# Altium project Wacky_Racer.PrjPcb
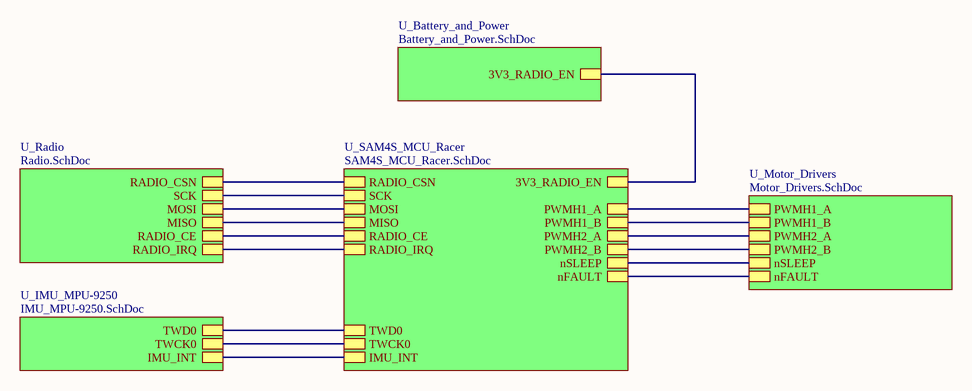
[diagram p0: Racer_Top_Level.SchDoc]
6 sheets, 131 parts. Net scope: hierarchical (ports join the sheet entries above them; power ports are global).
Board file: car_template 2020V3.PcbDoc
Sheets:
  Racer_Top_Level.SchDoc
    U_Battery_and_Power = Battery_and_Power.SchDoc
    U_Motor_Drivers = Motor_Drivers.SchDoc
    U_Radio = Radio.SchDoc
    U_SAM4S_MCU_Racer = SAM4S_MCU_Racer.SchDoc
    U_IMU_MPU-9250 = IMU_MPU-9250.SchDoc

## Sheet Racer_Top_Level.SchDoc
size A3; Address1: ECE Department; Address2: University of Canterbury; Address3: Christchurch 8041; Address4: New Zealand; Revision: 1

### Sub-sheets
U_Battery_and_Power = Battery_and_Power.SchDoc: 3V3_RADIO_EN
U_IMU_MPU-9250 = IMU_MPU-9250.SchDoc: TWD0, TWCK0, IMU_INT
U_Motor_Drivers = Motor_Drivers.SchDoc: PWMH1_A, PWMH1_B, PWMH2_A, PWMH2_B, nSLEEP, nFAULT
U_Radio = Radio.SchDoc: RADIO_CSN, SCK, MOSI, MISO, RADIO_CE, RADIO_IRQ
U_SAM4S_MCU_Racer = SAM4S_MCU_Racer.SchDoc: MISO, MOSI, SCK, RADIO_IRQ, PWMH1_A, PWMH1_B, PWMH2_A, PWMH2_B, nSLEEP, nFAULT, RADIO_CE, RADIO_CSN, 3V3_RADIO_EN, TWD0, TWCK0, IMU_INT

### Nets
MISO: sheet U_Radio/MISO, sheet U_SAM4S_MCU_Racer/MISO
MOSI: sheet U_Radio/MOSI, sheet U_SAM4S_MCU_Racer/MOSI
PWMH1_A: sheet U_Motor_Drivers/PWMH1_A, sheet U_SAM4S_MCU_Racer/PWMH1_A
PWMH2_A: sheet U_Motor_Drivers/PWMH2_A, sheet U_SAM4S_MCU_Racer/PWMH2_A
RADIO_CE: sheet U_Radio/RADIO_CE, sheet U_SAM4S_MCU_Racer/RADIO_CE
RADIO_CSN: sheet U_Radio/RADIO_CSN, sheet U_SAM4S_MCU_Racer/RADIO_CSN
RADIO_IRQ: sheet U_Radio/RADIO_IRQ, sheet U_SAM4S_MCU_Racer/RADIO_IRQ
SCK: sheet U_Radio/SCK, sheet U_SAM4S_MCU_Racer/SCK
TWCK0: sheet U_SAM4S_MCU_Racer/TWCK0, sheet U_IMU_MPU-9250/TWCK0
TWD0: sheet U_SAM4S_MCU_Racer/TWD0, sheet U_IMU_MPU-9250/TWD0
NetR??_2: sheet U_Battery_and_Power/3V3_RADIO_EN, sheet U_SAM4S_MCU_Racer/3V3_RADIO_EN
NetU1_37: sheet U_SAM4S_MCU_Racer/IMU_INT, sheet U_IMU_MPU-9250/IMU_INT
NetU1_41: sheet U_Motor_Drivers/nSLEEP, sheet U_SAM4S_MCU_Racer/nSLEEP
NetU1_42: sheet U_Motor_Drivers/nFAULT, sheet U_SAM4S_MCU_Racer/nFAULT
NetU1_44: sheet U_Motor_Drivers/PWMH2_B, sheet U_SAM4S_MCU_Racer/PWMH2_B
NetU1_47: sheet U_Motor_Drivers/PWMH1_B, sheet U_SAM4S_MCU_Racer/PWMH1_B

### Notes on the sheet
- Title
- Drawn by:
- Date:
- Time:
- Revision:
- Sheet
- of
- File:

## Sheet Battery_and_Power.SchDoc
size A3; Address1: ECE Department; Address2: University of Canterbury; Address3: Christchurch 8041; Address4: New Zealand; Revision: 1
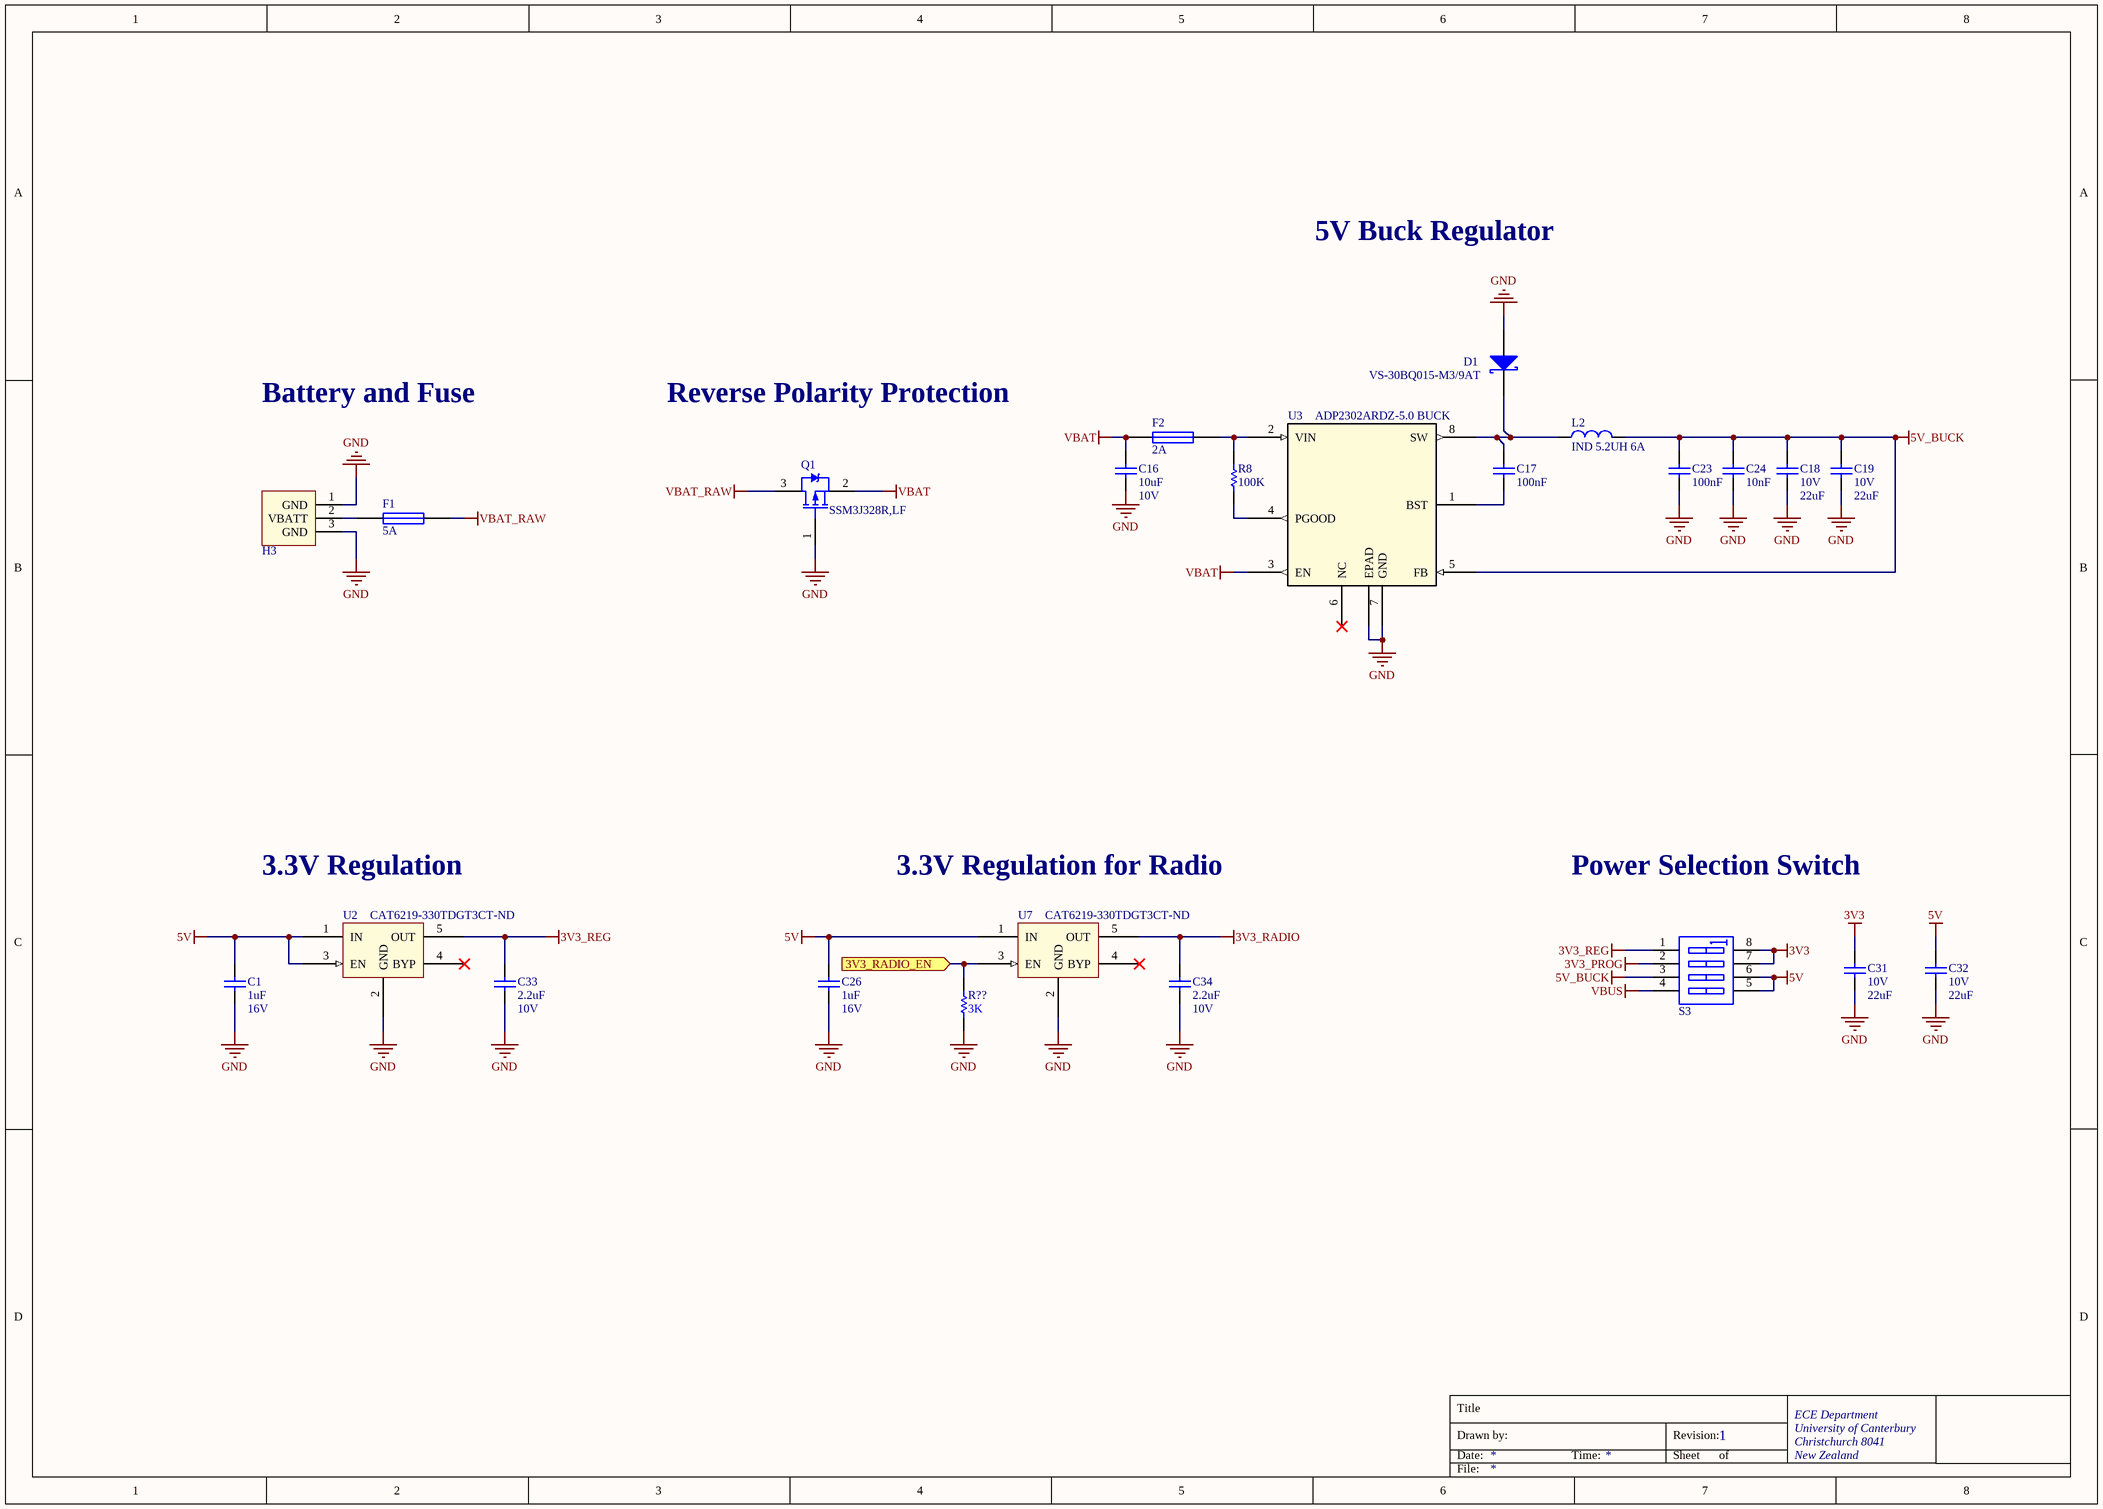
[diagram p1: Battery_and_Power.SchDoc]

### Parts
C1  Max Voltage: 16V  [CAPC1608L]  (hidden comment: 1uF)
C16  Max Voltage: 10V  [CAPC2012L]  (hidden comment: 10uF)
C17  100nF  [CAPC1608L]
C18  Max Voltage: 10V  [CAPC3216L]  (hidden comment: 22uF)
C19  Max Voltage: 10V  [CAPC3216L]  (hidden comment: 22uF)
C23  100nF  [CAPC1608L]
C24  10nF  [CAPC1608L]
C26  Max Voltage: 16V  [CAPC1608L]  (hidden comment: 1uF)
C31  Max Voltage: 10V  [CAPC3216L]  (hidden comment: 22uF)
C32  Max Voltage: 10V  [CAPC3216L]  (hidden comment: 22uF)
C33  Max Voltage: 10V  [CAPC1608L]  (hidden comment: 2.2uF)
C34  Max Voltage: 10V  [CAPC1608L]  (hidden comment: 2.2uF)
D1  VS-30BQ015-M3/9AT  [SMC]
F1  5A  [RESC3216N]
F2  2A  [RESC3216N]
H3  Battery_HEADER_3pin  [BATT_HEADER_3POS]  (value not drawn)
L2  IND 5.2UH 6A  [INDUCTOR5u2]
Q1  SSM3J328R,LF  [SOT23_L]
R8  100K  [RESC1608L]
R??  3K  [RESC1608L]
S3  WS_SW DIP-4  [DIP_SW_4WAY_SMD -]  (value not drawn)
U2  Supplier Part Number: CAT6219-330TDGT3CT-ND  [SOT95P280X145-5N]  (hidden comment: CAT6219-330TDGT3)
U3  ADP2302ARDZ-5.0 BUCK  [RD_8_1]
U7  Supplier Part Number: CAT6219-330TDGT3CT-ND  [SOT95P280X145-5N]  (hidden comment: CAT6219-330TDGT3)

### Ports
3V3_RADIO_EN (in)

### Nets
3V3: C31.2 S3.7(B2) S3.8(B1)
3V3_PROG: S3.2(A2)
3V3_RADIO: C34.2 U7.5(OUT)
3V3_REG: C33.2 S3.1(A1) U2.5(OUT)
5V: C1.2 C26.2 C32.2 S3.5(B4) S3.6(B3) U2.1(IN) U2.3(EN) U7.1(IN)
5V_BUCK: C18.2 C19.2 C23.2 C24.2 L2.2 S3.3(A3) U3.5(FB)
GND: C1.1 C16.1 C18.1 C19.1 C23.1 C24.1 C26.1 C31.1 C32.1 C33.1 C34.1 D1.1(A) H3.1(GND) H3.3(GND) Q1.1 R??.1 U2.2(GND) U3.7(GND) U3.EPAD U7.2(GND)
VBAT: C16.2 F2.1 Q1.2 U3.3(EN)
VBAT_RAW: F1.2 Q1.3
VBUS: S3.4(A4)
NetC17_1: C17.1 U3.1(BST)
NetC17_2: C17.2 D1.2(K) L2.1 U3.8(SW)
NetF1_1: F1.1 H3.2(VBATT)
NetF2_2: F2.2 R8.2 U3.2(VIN)
NetR8_1: R8.1 U3.4(PGOOD)
NetR??_2: R??.2 U7.3(EN) ; port 3V3_RADIO_EN

Not connected (* = marked no-connect by the designer): U2 4(BYP)*; U3 6(NC)*; U7 4(BYP)*

### Notes on the sheet
- 5V Buck Regulator
- Battery and Fuse
- Reverse Polarity Protection
- 3.3V Regulation
- 3.3V Regulation for Radio
- Power Selection Switch
- Title
- Drawn by:
- Date:
- Time:
- Revision:
- Sheet
- of
- File:

### Library data of the parts
C1 C26 = CC_1uF_0603: CAP CER 1uF Y5V -20% +80% 16V 0603; PackageReference: 0603; Code_IPC: 1608 [0603]; Verify: *; Supplier: ECE Dept; Storage Location: PCB Assembly WS; Value: 1uF
C16 = CC_10uF_0805_10V: CAP CER 10uF X7R +-20% 10V 0805; Note: Footprint corresponds to dimensions for bulk cassette packaging. This case size has tightened tolerances.; PackageReference: 0805; Code_IPC: 2012[0805]; Verify: *; Supplier: ECE Dept; Storage Location: PCB Assembly WS; Value: 10uF
C17 C23 = CC_100nF_0603: CAP CER 100nF X7R +-10% 50V 0603; PackageReference: 0603; Code_IPC: 1608 [0603]; Verify: *; Supplier: ECE Dept; Storage Location: PCB Assembly WS; Value: 100nF
C18 C19 C31 C32 = CC_22uF_1206: CAP CER 22uF Y5V -20% +80% 10V 1206; Verify: *; Supplier: ECE Dept; Storage Location: PCB Assembly WS; Dielectric: Y5V; Footprint: 1206 (3216 metric); Value: 22uF
C24 = CC_10nF_0603: CAP CER 10nF X7R +-10% 50V 0603; PackageReference: 0603; Code_IPC: 1608 [0603]; Verify: *; Supplier: ECE Dept; Storage Location: PCB Assembly WS; Value: 10nF
C33 C34 = CC_2.2uF_0603: CAP CER 2.2uF X5R +-20% 10V 0603; PackageReference: 0603; Code_IPC: 1608 [0603]; Verify: *; Supplier: ECE Dept; Storage Location: PCB Assembly WS; Value: 2.2uF
D1 = DS_VS-30BQ015-M3: DIODE, SCHOTTKY, 3A, 15V, DO-214AB / SMC; Manufacturer: Vishay Semiconductors; Forward Voltage: 350mV; Max Forward Surge Current (Ifsm): 650A; Peak Reverse Current: 4mA; Average Rectified Current: 3A; Max Reverse Voltage (DC): 15V; Supplier: Digi-Key; ComponentLink1URL: https://datasheet.ciiva.com/36181/vs-30bq015-m3-9at-36181258.pdf; ComponentLink1Description: https://datasheet.ciiva.com/36181/vs-30bq015-m3-9at-36181258.pdf; Supplier 1: Digi-Key; Supplier 2: Element14; Supplier Part Number 1: VS-30BQ015-M3/9ATGIDKR-ND; Supplier Part Number 2: 2628288; Supplier Part Number: VS-30BQ015-M3/9AT-ND; Manufacturer Part Number: VS-30BQ015-M3/9AT
F1 = FS_Fuse_5.0A: Fuse 5.0A Fast Acting 1206 SMD; Manufacturer Part Number: C1F5; Manufacturer: Bel TRP; Voltage Rating (AC): 125V; Voltage Rating (DC): 63V; DC Cold Resistance: 19mR; Fuse Type: Board Mount (Cartridge Style Excluded); Approvals: CE,cURus; Mount: Surface Mount; Case/Package: 1206; Number of Pins: 2; Case Code (Metric): 3216; Case Code (Imperial): 1206; Contact Plating: Nickel,Tin; Min Operating Temperature: -55°C; Max Operating Temperature: 125°C; Packaging: Tape and Reel; Voltage Rating: 125V; Length: 0.126inch; Width: 0.062inch; Supplier 1: Digi-Key; Stock 1: 725; Pricing 1: 1=0.32, 5=0.312, 10=0.298, 50=0.2662, 100=0.2479, 250=0.22032, 500=0.1836, 1000=0.17442 (USD); ComponentLink1URL: http://www.farnell.com/datasheets/2571625.pdf; ComponentLink1Description: http://www.farnell.com/datasheets/2571625.pdf; ComponentLink2URL: http://belfuse.com/pdfs/C1F.pdf; ComponentLink2Description: http://belfuse.com/pdfs/C1F.pdf; ComponentLink3URL: http://www.mouser.com/ds/2/643/C1F-594910.pdf; ComponentLink3Description: http://www.mouser.com/ds/2/643/C1F-594910.pdf; ComponentLink4URL: https://belfuse.com/resources/StewartConnector/C1F.pdf; ComponentLink4Description: https://belfuse.com/resources/StewartConnector/C1F.pdf; Current Rating: 5A; Supplier Part Number 1: 507-1886-1-ND; Supplier 2: Element14; Supplier Part Number 2: 2848595; Value: 5A
F2 = FS_Fuse_2.0A: Fuse 2.0A Very Fast Acting 1206 SMD; Manufacturer: MULTICOMP; Manufacturer PN: MC12CF 002; Supplier: ECE Dept; Storage Location: PCB Assembly WS; Supplier 1: Farnell; Supplier Part Number 1: 1841029; Manufacturer Part Number: MC12CF 002; Value: 2A
H3 = Battery_HEADER_3pin: 3Pin Header 2.54mm spacing
L2 = CDRH104RNP-5R2NC: FIXED IND 5.2UH 6A 22 MOHM SMD; Manufacturer: Sumida America Components Inc.; Material - Core: Ferrite; Tolerance: ±30%; Current - Saturation: 5.6A; Shielding: Shielded; DC Resistance (DCR): 22 mOhm Max; Supplier 1: Digi-Key; Manufacturer Part Number: CDRH104RNP-5R2NC; RoHS: RoHS Compliant; Category: Inductors, Coils, Chokes; Stock 1: 3849; Pricing 1: 1=2.9, 10=2.678, 100=1.8743, 500=1.5173 (NZD); Packaging: Cut Tape (CT); Part Status: Active; Type: -; Q @ Freq: -; Frequency - Self Resonant: -; Ratings: -; Operating Temperature: -40°C ~ 100°C; Mounting Type: Surface Mount; Package / Case: Nonstandard; Supplier Device Package: -; Size / Dimension: 0.402" L x 0.394" W (10.20mm x 10.00mm); Height - Seated (Max): 0.157" (4.00mm); ComponentLink1URL: http://products.sumida.com/products/pdf/CDRH104R.pdf; ComponentLink1Description: http://products.sumida.com/products/pdf/CDRH104R.pdf; Supplier Part Number 1: 308-2280-1-ND
Q1 = TM_SSM3J328R: MOSFET P-CH 20V 6A SOT23-3; Manufacturer: Toshiba; FET Feature: Logic Level Gate, 1.5V Drive; FET Type: MOSFET P-Channel, Metal Oxide; Gate Charge (Qg) @ Vgs: 12.8nC @ 4.5V; Input Capacitance (Ciss) @ Vds: 840pF @ 10V; Power - Max: 1W; Rds On Max: 29.8mR; Drain to Source Resistance: 47.4mR; Turn-On Delay Time: 32ns; Power Dissipation: 2W; Number of Channels: 1; Turn-Off Delay Time: 107ns; Gate to Source Voltage (Vgs): 8V; Input Capacitance: 840pF; Element Configuration: Single; Drain to Source Breakdown Voltage: -20V; Vgs(th) (Max) @ Id: 1V @ 1mA; Current - Continuous Drain (Id) @ 25° C: 6A; Drain to Source Voltage (Vdss): 20V; Package / Case: SOT-23-3 Flat Leads; Supplier Device Package: SOT-23F; Pricing: 1=0.79, 10=0.658, 25=0.5772, 100=0.4939, 250=0.42836, 500=0.36284, 1000=0.27972 (NZD); Storage Location: PCB Assembly WS; Supplier: Digi-Key; ComponentLink1URL: https://datasheet.ciiva.com/11158/ssm3j328r-datasheet-en-20140301-11158652.pdf; ComponentLink1Description: https://datasheet.ciiva.com/11158/ssm3j328r-datasheet-en-20140301-11158652.pdf; Supplier Part Number: SSM3J328RLFDKR-ND; Max Operating Temperature: 150°C; Mount: Surface Mount; Packaging: Tape and Reel; Min Operating Temperature: -55°C; Continuous Drain Current (ID): 6A; Radiation Hardening: No; Max Power Dissipation: 1W; Package Quantity: 3000; Case/Package: SOT-23-3; Number of Pins: 3; Number of Elements: 1; Supplier 1: Digi-Key; Supplier Part Number 1: SSM3J328RLFDKR-ND; Manufacturer Part Number: SSM3J328R,LF
R8 = RS_100K: RES 100K OHM 1/10W 5% 0603 SMD; Storage Location: PCB Assembly WS; Supplier: ECE Dept; Value: 100K
R?? = RS_3K: RES 3K OHM 1/10W 5% 0603 SMD; Storage Location: PCB Assembly WS; Supplier: ECE Dept; Value: 3K
S3 = WS_SW DIP-4: DIP Switch, 4 Position, SPST SMD; Manufacturer: OMRON ELECTRONIC COMPONENTS; Manufacturer Part Number: A6SN-4101; Contact Current DC Max: 25; External Length / Height: 12.1; No. of Switch Positions: 4; Pitch Spacing: 2.54; Contact Configuration: SPST; Supplier 1: Farnell; Supplier Part Number 1: 2029425; Storage Location: PCB Assembly WS; Supplier: ECE Dept
U2 U7 = SV_CAT6219-330TDGT3: IC REG LIN 3.3V 500MA TSOT23-5; Voltage - Input (Max): 5.5V; Voltage Dropout (Max): 0.5V @ 500mA; Manufacturer Part Number: CAT6219-330TDGT3; Base Part Number: CAT6219; Current - Output: 500mA; Package / Case: SOT-23-5 Thin, TSOT-23-5; Supplier: Digi-Key; Supplier Device Package: TSOT-23-5; Voltage - Output (Min/Fixed): 3.3V; ComponentLink1URL: http://www.onsemi.com/pub/Collateral/CAT6219-D.PDF; ComponentLink1Description: http://www.onsemi.com/pub/Collateral/CAT6219-D.PDF; Supplier 1: Digi-Key
U3 = ADP2302ARDZ-5.0-R7: IC REG BUCK 5V 2A 8SOIC; Vendor: Analog Devices Inc; Frequency - Switching: 700kHz; Output Type: Fixed; Voltage - Input (Max): 20V; Manufacturer_Part_Number: ADP2302ARDZ-5.0-R7; Type: DEV; Value: Value; Supplier 1: Digi-Key; Current - Output: 2A; Voltage - Output (Min/Fixed): 5V; Supplier Part Number 1: ADP2302ARDZ-5.0-R7CT-ND

## Sheet Motor_Drivers.SchDoc
size A3; Address1: ECE Department; Address2: University of Canterbury; Address3: Christchurch 8041; Address4: New Zealand; Revision: 1
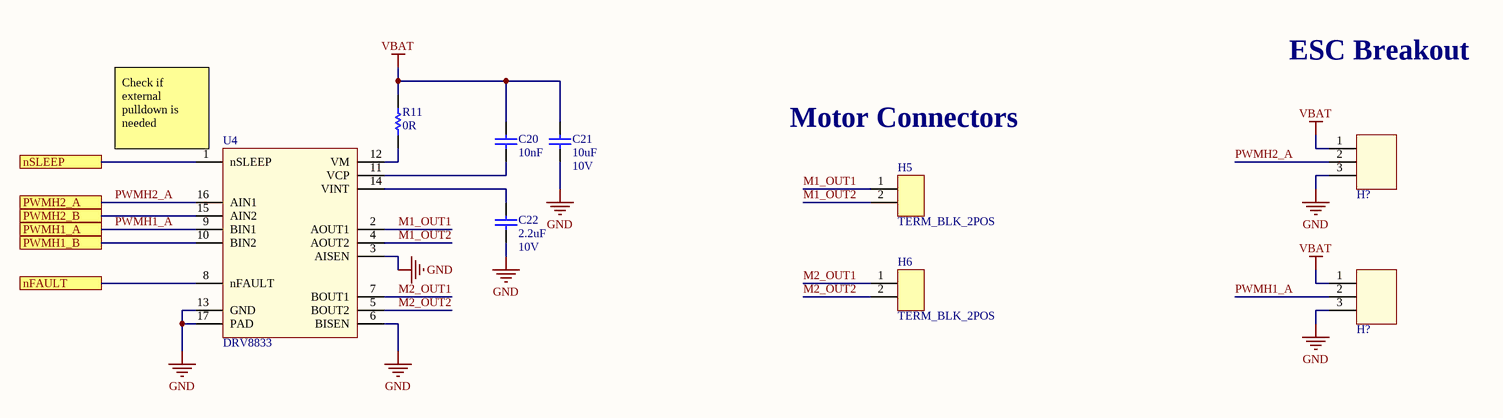
[diagram p2: Motor_Drivers.SchDoc]

### Parts
(Parts that share a designator on the sheet are numbered #1, #2 ... from top to bottom, then left to right.)
C20  10nF  [CAPC1608L]
C21  Max Voltage: 10V  [CAPC2012L]  (hidden comment: 10uF)
C22  Max Voltage: 10V  [CAPC1608L]  (hidden comment: 2.2uF)
H5  TERM_BLK_2POS  [TERM_BLK_2POS]
H6  TERM_BLK_2POS  [TERM_BLK_2POS]
H7#1  HEADER_3  [HEADER_3POS]  (value not drawn)
H8  HEADER_3  [HEADER_3POS]  (value not drawn)
R11  0R  [RESC1608L]
U4  DRV8833  [HTSOP16]

### Ports
nFAULT, nSLEEP, PWMH1_A, PWMH1_B, PWMH2_A, PWMH2_B

### Nets
GND: C21.1 C22.1 H7#1.3 H8.3 U4.3(AISEN) U4.6(BISEN) U4.13(GND) U4.17(PAD)
VBAT: C20.2 C21.2 H7#1.1 H8.1 R11.2
M1_OUT1: H5.1 U4.2(AOUT1)
M1_OUT2: H5.2 U4.4(AOUT2)
M2_OUT1: H6.1 U4.7(BOUT1)
M2_OUT2: H6.2 U4.5(BOUT2)
PWMH1_A: H8.2 U4.9(BIN1) ; port PWMH1_A
PWMH2_A: H7#1.2 U4.16(AIN1) ; port PWMH2_A
NetC20_1: C20.1 U4.11(VCP)
NetC22_2: C22.2 U4.14(VINT)
NetR11_1: R11.1 U4.12(VM)
NetU1_41: U4.1(nSLEEP) ; port nSLEEP
NetU1_42: U4.8(nFAULT) ; port nFAULT
NetU1_44: U4.15(AIN2) ; port PWMH2_B
NetU1_47: U4.10(BIN2) ; port PWMH1_B

### Notes on the sheet
- ESC Breakout
- (near U4) Check if external pulldown is needed
- Motor Connectors
- Title
- Drawn by:
- Date:
- Time:
- Revision:
- Sheet
- of
- File:

### Library data of the parts
C20 = CC_10nF_0603: CAP CER 10nF X7R +-10% 50V 0603; PackageReference: 0603; Code_IPC: 1608 [0603]; Verify: *; Supplier: ECE Dept; Storage Location: PCB Assembly WS; Value: 10nF
C21 = CC_10uF_0805_10V: as C16 on sheet Battery_and_Power; PackageReference: 0805; Code_IPC: 2012[0805]; Verify: *; Supplier: ECE Dept; Storage Location: PCB Assembly WS; Value: 10uF
C22 = CC_2.2uF_0603: CAP CER 2.2uF X5R +-20% 10V 0603; PackageReference: 0603; Code_IPC: 1608 [0603]; Verify: *; Supplier: ECE Dept; Storage Location: PCB Assembly WS; Value: 2.2uF
H5 H6 = TERM_BLK_2POS: 2 Position Terminal Block 7.62mm spacing
H7#1 H8 = HEADER_3: 3Pin Header 2.54mm spacing
R11 = RS_0R0: RES 0.0 OHM 1/10W 5% 0603 SMD; Storage Location: PCB Assembly WS; Supplier: ECE Dept; Value: 0R
U4 = DRV8833: Dual H-Bridge Motor Driver 1.5A

## Sheet Radio.SchDoc: Wacky Control Radio
size A3; Author: Josiah Craw; Address1: ECE Department; Address2: University of Canterbury; Address3: Christchurch 8041; Address4: New Zealand; Revision: 1
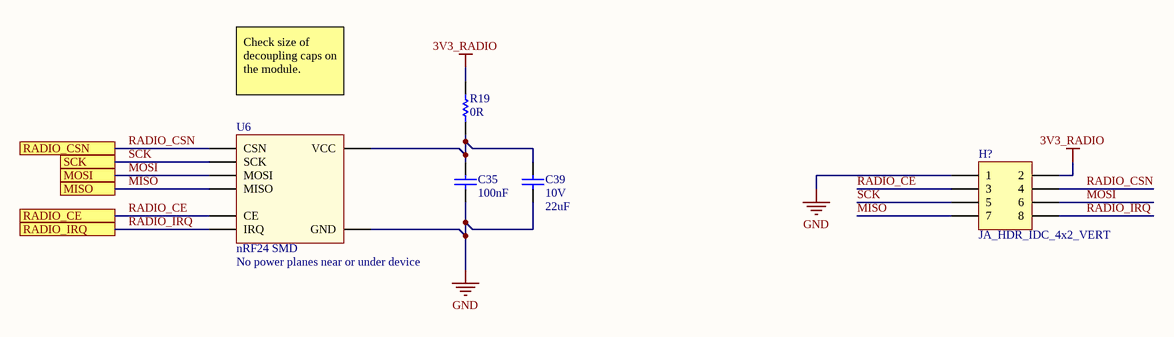
[diagram p3: Radio.SchDoc]

### Parts
C35  100nF  [CAPC1608L]
C39  Max Voltage: 10V  [CAPC3216L]  (hidden comment: 22uF)
H10  JA_HDR_IDC_4x2_VERT  [IDC2.54-V08D]
R19  0R  [RESC1608L]
U6  nRF24 SMD  Warning: No power planes near or under device  [NRF24]

### Ports
MISO, MOSI, RADIO_CE, RADIO_CSN, RADIO_IRQ, SCK

### Nets
3V3_RADIO: H10.2 R19.2
GND: C35.1 C39.1 H10.1 U6.2(GND)
MISO: H10.7 U6.7(MISO) ; port MISO
MOSI: H10.6 U6.6(MOSI) ; port MOSI
RADIO_CE: H10.3 U6.3(CE) ; port RADIO_CE
RADIO_CSN: H10.4 U6.4(CSN) ; port RADIO_CSN
RADIO_IRQ: H10.8 U6.8(IRQ) ; port RADIO_IRQ
SCK: H10.5 U6.5(SCK) ; port SCK
NetC35_2: C35.2 C39.2 R19.1 U6.1(VCC)

### Notes on the sheet
- Check size of decoupling caps on the module.

### Library data of the parts
C35 = CC_100nF_0603: CAP CER 100nF X7R +-10% 50V 0603
C39 = CC_22uF_1206: CAP CER 22uF Y5V -20% +80% 10V 1206
H10 = JA_HDR_IDC_4x2_VERT: IDC Header, 2.54mm, 8-Pin, Vert; Manufacturer: Amphenol FCI; Manufacturer Part Number: 75869-132LF; Number of Positions: 8; Max Voltage Rating (AC): 500V; Connector Type: Male Pin; Gender: Male; Current Rating: 3A; Row Spacing: 0.1inch; Mating Post Length: 6mm
R19 = RS_0R0: RES 0.0 OHM 1/10W 5% 0603 SMD
U6 = NRF24: nRF24 SMD Module

## Sheet SAM4S_MCU_Racer.SchDoc: Wacky2020 AD19 HAT test
size A3; DrawnBy: Group 19; Address1: ECE Department; Address2: University of Canterbury; Address3: Christchurch 8041; Address4: New Zealand; Revision: 1
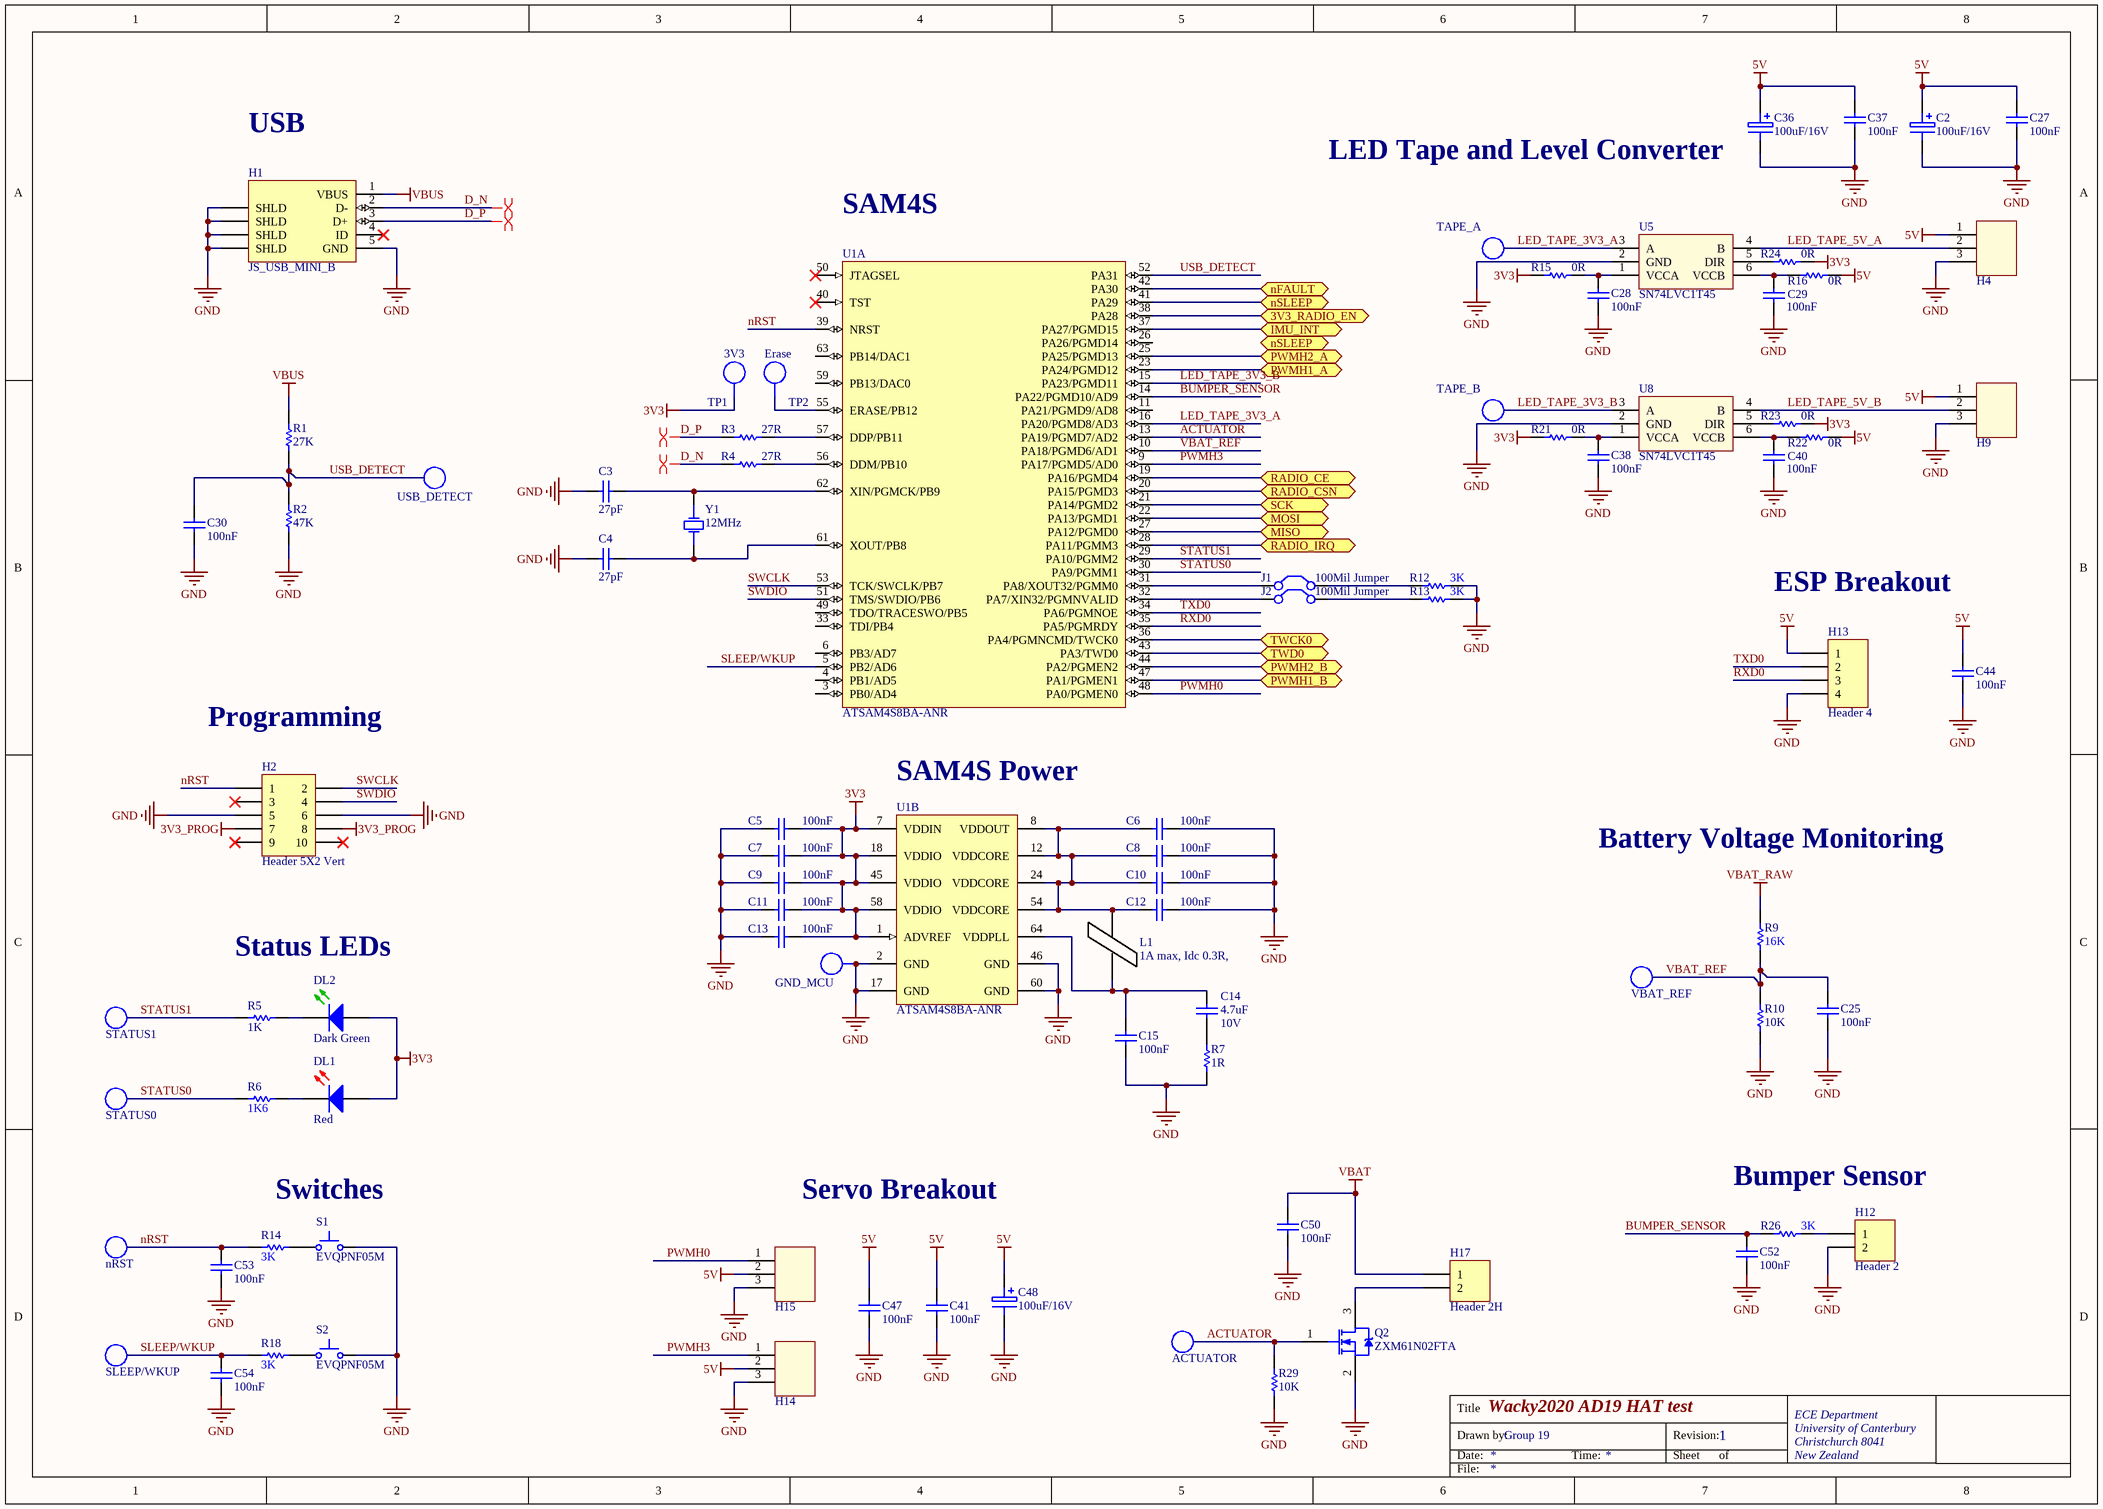
[diagram p4: SAM4S_MCU_Racer.SchDoc]

### Parts
(Parts that share a designator on the sheet are numbered #1, #2 ... from top to bottom, then left to right.)
ACTUATOR  TP_0603  [TP_0603]  (value not drawn)
C2  100uF/16V  [NICH-1]
C3  27pF  [CAPC1608L]
C4  27pF  [CAPC1608L]
C5  100nF  [CAPC1608L]
C6  100nF  [CAPC1608L]
C7  100nF  [CAPC1608L]
C8  100nF  [CAPC1608L]
C9  100nF  [CAPC1608L]
C10  100nF  [CAPC1608L]
C11  100nF  [CAPC1608L]
C12  100nF  [CAPC1608L]
C13  100nF  [CAPC1608L]
C14  Max Voltage: 10V  [CAPC1608N]  (hidden comment: 4.7uF)
C15  100nF  [CAPC1608L]
C25  100nF  [CAPC1608L]
C27  100nF  [CAPC1608L]
C28  100nF  [CAPC1608L]
C29  100nF  [CAPC1608L]
C30  100nF  [CAPC1608L]
C36#1  100uF/16V  [NICH-1]
C37#1  100nF  [CAPC1608L]
C38#1  100nF  [CAPC1608L]
C40  100nF  [CAPC1608L]
C41  100nF  [CAPC1608L]
C44  100nF  [CAPC1608L]
C47  100nF  [CAPC1608L]
C48  100uF/16V  [NICH-1]
C50  100nF  [CAPC1608L]
C52  100nF  [CAPC1608L]
C53  100nF  [CAPC1608L]
C54  100nF  [CAPC1608L]
DL1  Red  [WL-SMCW0603]
DL2  Dark Green  [WL-SMCW0603]
GND_MCU  TP  [TP_1206]  (value not drawn)  (no BOM)
H1  JS_USB_MINI_B  [USB/SM0.8-6H5]
H2  Header 5X2 Vert  [IDC2.54-V10D]
H4  HEADER_3  [HEADER_3POS]  (value not drawn)
H9  HEADER_3  [HEADER_3POS]  (value not drawn)
H12  Header 2  [HDR1X2]
H13  Header 4  [HDR1X4]
H14  HEADER_3  [HEADER_3POS]  (value not drawn)
H15  HEADER_3  [HEADER_3POS]  (value not drawn)
H17  Header 2H  [HDR1X2H]
J1  100Mil Jumper  [JMP2.54]
J2  100Mil Jumper  [JMP2.54]
L1  1A max, Idc 0.3R,  [INDC3216L]
nRST  TP_0603  [TP_0603]  (value not drawn)
Q2  ZXM61N02FTA  [SOT23_L]
R1  27K  [RESC1608L]
R2  47K  [RESC1608N]
R3  27R  [RESC1608L]
R4  27R  [RESC1608L]
R5  1K  [RESC1608L]
R6  1K6  [RESC1608L]
R7  1R  [RESC3216L]
R9  16K  [RESC1608L]
R10  10K  [RESC1608L]
R12  3K  [RESC1608L]
R13  3K  [RESC1608L]
R14  3K  [RESC1608L]
R15  0R  [RESC1608L]
R16  0R  [RESC1608L]
R18  3K  [RESC1608L]
R21  0R  [RESC1608L]
R22  0R  [RESC1608L]
R23  0R  [RESC1608L]
R24  0R  [RESC1608L]
R26  3K  [RESC1608L]
R29  10K  [RESC1608L]
S1  EVQPNF05M  [EVQPNF05M]
S2  EVQPNF05M  [EVQPNF05M]
SLEEP/WKUP  TP_0603  [TP_0603]  (value not drawn)
STATUS0  TP_0603  [TP_0603]  (value not drawn)
STATUS1  TP_0603  [TP_0603]  (value not drawn)
TAPE_A  TP_0603  [TP_0603]  (value not drawn)
TAPE_B  TP_0603  [TP_0603]  (value not drawn)
TP1  3V3  [TP_1206]  (no BOM)
TP2  Erase  [TP_1206]  (no BOM)
U1  ATSAM4S8BA-ANR  [LQFP64_L]  (parts A,B of 2)
U5  SN74LVC1T45  [SOT23-6_N]
U8#1  SN74LVC1T45  [SOT23-6_N]
USB_DETECT  TP_0603  [TP_0603]  (value not drawn)
VBAT_REF  TP_0603  [TP_0603]  (value not drawn)
Y1  12MHz  [6.0X3.5-4]

### Ports
3V3_RADIO_EN (bidir), IMU_INT (bidir), MISO (bidir), MOSI (bidir), nFAULT (bidir), nSLEEP (bidir), PWMH1_A (bidir), PWMH1_B (bidir), PWMH2_A (bidir), PWMH2_B (bidir), RADIO_CE (bidir), RADIO_CSN (bidir), RADIO_IRQ (bidir), SCK (bidir), TWCK0 (bidir), TWD0 (bidir)

### Nets
3V3: C5.2 C7.2 C9.2 C11.2 C13.2 DL1.2(A) DL2.2(A) R15.1 R21.1 R23.2 R24.2 TP1.1 U1.1(ADVREF) U1.7(VDDIN) U1.18(VDDIO) U1.45(VDDIO) U1.58(VDDIO)
3V3_PROG: H2.7 H2.8
5V: C2.2 C27.2 C36#1.2 C37#1.2 C41.2 C44.2 C47.2 C48.2 H4.1 H9.1 H13.1 H14.2 H15.2 R16.2 R22.2
GND: C2.1 C3.1 C4.1 C5.1 C6.2 C7.1 C8.2 C9.1 C10.2 C11.1 C12.2 C13.1 C15.2 C25.1 C27.1 C28.1 C29.1 C30.1 C36#1.1 C37#1.1 C38#1.1 C40.1 C41.1 C44.1 C47.1 C48.1 C50.1 C52.1 C53.1 C54.1 GND_MCU.1 H1.5(GND) H1.6(SHLD) H1.7(SHLD) H1.8(SHLD) H1.9(SHLD) H2.5 H2.6 H4.3 H9.3 H12.2 H13.4 H14.3 H15.3 Q2.2 R2.1 R7.1 R10.1 R12.2 R13.2 R29.1 S1.1 S2.1 U1.2(GND) U1.17(GND) U1.46(GND) U1.60(GND) U5.2(GND) U8#1.2(GND)
VBAT: C50.2 H17.1
VBAT_RAW: R9.2
VBUS: H1.1(VBUS) R1.2
ACTUATOR: ACTUATOR.1(TP) Q2.1 R29.2 U1.13(PA19/PGMD7/AD2)
BUMPER_SENSOR: C52.2 R26.1 U1.14(PA22/PGMD10/AD9)
D_N: H1.2(D-) R4.1
D_P: H1.3(D+) R3.1
LED_TAPE_3V3_A: TAPE_A.1(TP) U1.16(PA20/PGMD8/AD3) U5.3(A)
LED_TAPE_3V3_B: TAPE_B.1(TP) U1.15(PA23/PGMD11) U8#1.3(A)
LED_TAPE_5V_A: H4.2 U5.4(B)
LED_TAPE_5V_B: H9.2 U8#1.4(B)
MISO: U1.27(PA12/PGMD0) ; port MISO
MOSI: U1.22(PA13/PGMD1) ; port MOSI
nRST: C53.2 H2.1 nRST.1(TP) R14.1 U1.39(NRST)
PWMH0: H15.1 U1.48(PA0/PGMEN0)
PWMH1_A: U1.23(PA24/PGMD12) ; port PWMH1_A
PWMH2_A: U1.25(PA25/PGMD13) ; port PWMH2_A
PWMH3: H14.1 U1.9(PA17/PGMD5/AD0)
RADIO_CE: U1.19(PA16/PGMD4) ; port RADIO_CE
RADIO_CSN: U1.20(PA15/PGMD3) ; port RADIO_CSN
RADIO_IRQ: U1.28(PA11/PGMM3) ; port RADIO_IRQ
RXD0: H13.3 U1.35(PA5/PGMRDY)
SCK: U1.21(PA14/PGMD2) ; port SCK
SLEEP/WKUP: C54.2 R18.1 SLEEP/WKUP.1(TP) U1.5(PB2/AD6)
STATUS0: R6.1 STATUS0.1(TP) U1.30(PA9/PGMM1)
STATUS1: R5.1 STATUS1.1(TP) U1.29(PA10/PGMM2)
SWCLK: H2.2 U1.53(TCK/SWCLK/PB7)
SWDIO: H2.4 U1.51(TMS/SWDIO/PB6)
TWCK0: U1.36(PA4/PGMNCMD/TWCK0) ; port TWCK0
TWD0: U1.43(PA3/TWD0) ; port TWD0
TXD0: H13.2 U1.34(PA6/PGMNOE)
USB_DETECT: C30.2 R1.1 R2.2 U1.52(PA31) USB_DETECT.1(TP)
VBAT_REF: C25.2 R9.1 R10.2 U1.10(PA18/PGMD6/AD1) VBAT_REF.1(TP)
NetC3_2: C3.2 U1.62(XIN/PGMCK/PB9) Y1.3(OSC2)
NetC4_2: C4.2 U1.61(XOUT/PB8) Y1.1(OSC1)
NetC6_1: C6.1 C8.1 C10.1 C12.1 L1.2 U1.8(VDDOUT) U1.12(VDDCORE) U1.24(VDDCORE) U1.54(VDDCORE)
NetC14_1: C14.1 R7.2
NetC14_2: C14.2 C15.1 L1.1 U1.64(VDDPLL)
NetC28_2: C28.2 R15.2 U5.1(VCCA)
NetC29_2: C29.2 R16.1 U5.6(VCCB)
NetC38#1_2: C38#1.2 R21.2 U8#1.1(VCCA)
NetC40_2: C40.2 R22.1 U8#1.6(VCCB)
NetDL1_1: DL1.1(K) R6.2
NetDL2_1: DL2.1(K) R5.2
NetH12_1: H12.1 R26.2
NetH17_2: H17.2 Q2.3
NetJ1_1: J1.1(C1) U1.31(PA8/XOUT32/PGMM0)
NetJ1_2: J1.2(C2) R12.1
NetJ2_1: J2.1(C1) U1.32(PA7/XIN32/PGMNVALID)
NetJ2_2: J2.2(C2) R13.1
NetR3_2: R3.2 U1.57(DDP/PB11)
NetR4_2: R4.2 U1.56(DDM/PB10)
NetR14_2: R14.2 S1.2
NetR18_2: R18.2 S2.2
NetR23_1: R23.1 U8#1.5(DIR)
NetR24_1: R24.1 U5.5(DIR)
NetR??_2: U1.38(PA28) ; port 3V3_RADIO_EN
NetTP2_1: TP2.1 U1.55(ERASE/PB12)
NetU1_37: U1.37(PA27/PGMD15) ; port IMU_INT
NetU1_41: U1.41(PA29) ; port nSLEEP
NetU1_42: U1.42(PA30) ; port nFAULT
NetU1_44: U1.44(PA2/PGMEN2) ; port PWMH2_B
NetU1_47: U1.47(PA1/PGMEN1) ; port PWMH1_B

Not connected (* = marked no-connect by the designer): H1 4(ID)*; H2 3* 9* 10*; U1 3(PB0/AD4) 4(PB1/AD5) 6(PB3/AD7) 11(PA21/PGMD9/AD8) 26(PA26/PGMD14) 33(TDI/PB4) 40(TST)* 49(TDO/TRACESWO/PB5) 50(JTAGSEL)* 59(PB13/DAC0) 63(PB14/DAC1)

### Layout directives
differential pair: D_N, D_P

### Notes on the sheet
- USB
- (near C36#1) LED Tape and Level Converter
- SAM4S
- ESP Breakout
- Programming
- (near U1) SAM4S Power
- Battery Voltage Monitoring
- Status LEDs
- Bumper Sensor
- Switches
- Servo Breakout
- Title
- Drawn by:
- Date:
- Time:
- Revision:
- Sheet
- of
- File:

### Library data of the parts
ACTUATOR nRST SLEEP/WKUP STATUS0 STATUS1 TAPE_A TAPE_B USB_DETECT VBAT_REF = TP_0603: Test Point 1.65X0.9X1.2mm SMD; Manufacturer: TE Connectivity AMP Connectors; Manufacturer Part Number: 1625854-3; Supplier 1: Digi-Key; Mounting Type: Surface Mount; Terminal: 0.063" x 0.031" x 0.045" (1.60mm x 0.80mm x 1.15mm); Type: PC Test Point; Supplier Part Number 1: A106145CT-ND
C2 C36#1 C48 = CA_100uF_16V: CAP ALUM 100uF 16V SMD; Manufacturer PN: UWX1C101MCL1GB; Manufacturer: Nichcon; Supplier 1: Farnell; Supplier Part Number 1: 1870677; Storage Location: PCB Assembly WS; Supplier: ECE Dept; Supplier 2: Digi-Key; Supplier Part Number 2: 493-2105-1-ND; Value: 100uF/16V
C3 C4 = CC_27pF_0603: CAP CER 27pF NPO/COG +-5% 50V 0603; PackageReference: 0603; Code_IPC: 1608 [0603]; Verify: *; Supplier: ECE Dept; Storage Location: PCB Assembly WS; Value: 27pF
C5-C13 C15 C25 C27-C30 C37#1 C38#1 C40 C41 C44 C47 C50 C52-C54 = CC_100nF_0603: CAP CER 100nF X7R +-10% 50V 0603; PackageReference: 0603; Code_IPC: 1608 [0603]; Verify: *; Supplier: ECE Dept; Storage Location: PCB Assembly WS; Value: 100nF
C14 = CC_4.7uF_0603: CAP CER 4.7uF X5R +-20%  10V 0603; Note: Footprint corresponds to dimensions for bulk cassette packaging. This case size has tightened tolerances.; PackageReference: 0805; Code_IPC: 2012[0805]; Verify: *; Supplier: ECE Dept; Storage Location: PCB Assembly WS; Value: 4.7uF
DL1 = DL_150060RS75000: LED Red 250mcd 0603 SMD; Manufacturer: WURTH ELEKTRONIK; Forward Current If: 30; Forward Voltage: 2; Lens Shape: Rectangular; Luminous Intensity: 250; Wavelength Typ: 625; Viewing Angle: 140°; LED Mounting: SMD; Supplier 1: Farnell; Supplier Part Number 1: 2322071; Manufacturer Part Number: 150060RS75000; Storage Location: PCB Assembly WS; Supplier: ECE Dept; LED Colour: Red
DL2 = DL_150060GS75000: LED Dk Green 430mcd 0603 SMD; Manufacturer: WURTH ELEKTRONIK; Forward Current If: 30; Wavelength Typ: 520; Forward Voltage: 3.2; Lens Shape: Rectangular; Luminous Intensity: 430; Viewing Angle: 140°; LED Mounting: SMD; Supplier 1: Farnell; Supplier Part Number 1: 2322070; Manufacturer Part Number: 150060GS75000; Storage Location: PCB Assembly WS; Supplier: ECE Dept; LED Colour: Dark Green
GND_MCU = TP_1206: Test-Point 3.3x1.6x2.1mm SMD; Manufacturer: Harwin Inc; Manufacturer Part Number: S1751-46R; Manufacturer PN: *; Storage Location: ProtoPlace; Mounting Type: Surface Mount; Type: PC Test Point; Supplier 1: Digi-Key; Supplier Part Number 1: 952-1478-2-ND; Supplier 2: Farnell; Supplier Part Number 2: 1826282; Supplier: ECE Dept; Value: TP
H1 = JS_USB_MINI_B_SMT: USB 2.0, Right Angle, SMT, B Type, Receptacle, 5 Position,; Manufacturer: FCI; Manufacturer PN: 10033526-N3212MLF; Supplier 1: Farnell; Supplier Part Number 1: 1824416; Storage Location: PCB Assembly WS; Supplier: ECE Dept
H2 = JA_HDR_IDC_5X2_VERT: IDC Header, 2,54mm, 10-Pin, Vert; Supplier: ECE Dept; Supplier 1: Farnell; Supplier Part Number 1: 1096985; Storage Location: ECE Dept Store
H4 H9 H14 H15 = HEADER_3: 3Pin Header 2.54mm spacing
H12 = Header 2: Header, 2-Pin; LatestRevisionDate: 17-Jul-2002; LatestRevisionNote: Re-released for DXP Platform.; Publisher: Altium Limited
H13 = Header 4: Header, 4-Pin; LatestRevisionDate: 17-Jul-2002; LatestRevisionNote: Re-released for DXP Platform.; Publisher: Altium Limited
H17 = Header 2H: Header, 2-Pin, Right Angle; LatestRevisionDate: 17-Jul-2002; LatestRevisionNote: Re-released for DXP Platform.; Publisher: Altium Limited
J1 J2 = TP_JUMPER: 2.54mm Jumper Thru Hole; Pitch Spacing: 2.54; No. of Rows: 1; No. of Positions: 2; Supplier: ECE Dept; Supplier 1: Farnell; Supplier Part Number 1: 1097975; Storage Location: ECE$ Store
L1 = IN_Ferrite-Bead: Ferrite Bead, Rdc 0.3R, Z100MHZ 600R, Imax 1A, SMD 1206; Manufacturer: FAIR-RITE; Manufacturer PN: 2512066017Y1; DC Current Rating: 1; DC Resistance Max: 0.08; Ferrite Case Style: 1206 ^3216 Metric]; Frequency Range: 50MHz to 1; Impedance: 600; Impedance Tolerance: ± 25%; Supplier: ECE Dept; Storage Location: PCB Assembly WS; Ferrite Mounting: SMD; Supplier 1: Farnell; Supplier Part Number 1: 1612060; Manufacturer Part Number: 2512066017Y1; Value: 1A max, Idc 0.3R,
Q2 = TM_ZXM61N02FTA: MOSFET N-CH 20V 1.7A SOT23-3; Manufacturer: Diodes Inc; FET Type: MOSFET N-Channel, Metal Oxide; Gate Charge (Qg) @ Vgs: 3.4nC @ 4.5V; Input Capacitance (Ciss) @ Vds: 160pF @ 15V; Power - Max: 625mW; Rds On (Max) @ Id, Vgs: 180 mOhm @ 930mA, 4.5V; Vgs(th) (Max) @ Id: 700mV @ 250µA; Supplier 1: Farnell; Supplier 2: Digi-Key; Current - Continuous Drain (Id) @ 25° C: 1.7A; Drain to Source Voltage (Vdss): 20V; Package / Case: TO-236-3, SC-59, SOT-23-3; Pricing: 1=0.79, 10=0.658, 25=0.5772, 100=0.4939, 250=0.42836, 500=0.36284, 1000=0.27972 (NZD); Supplier Part Number 1: 9525270; Supplier Part Number 2: ZXM61N02FCT-ND; Storage Location: PCB Assembly WS; Supplier: ECE Dept; Manufacturer Part Number: ZXM61N02FTA
R1 = RS_27K: RES 27K OHM 1/10W 5% 0603 SMD; Storage Location: PCB Assembly WS; Supplier: ECE Dept; Value: 27K
R2 = RS_47K: RES 47.0K OHM 1/10W 5% 0603 SMD; Storage Location: PCB Assembly WS; Supplier: ECE Dept; Value: 47K
R3 R4 = RS_27R: RES 27 OHM 1/10W 5% 0603 SMD; Storage Location: PCB Assembly WS; Supplier: ECE Dept; Value: 27R
R5 = RS_1K: RES 1.0K OHM 1/10W 5% 0603 SMD; Storage Location: PCB Assembly WS; Supplier: ECE Dept; Value: 1K
R6 = RS_1K6: RES 1.6K OHM 1/10W 5% 0603 SMD; Storage Location: PCB Assembly WS; Supplier: ECE Dept; Value: 1K6
R7 = RT_1R: RES 1R OHM 1/4W 5% 1206 SMD; Storage Location: PCB Assembly WS; Supplier: ECE Dept; Value: 1R
R9 = RS_16K: RES 16K OHM 1/10W 5% 0603 SMD; Storage Location: PCB Assembly WS; Supplier: ECE Dept; Value: 16K
R10 R29 = RS_10K: RES 10.0K OHM 1/10W 5% 0603 SMD; Storage Location: PCB Assembly WS; Supplier: ECE Dept; Value: 10K
R12-R14 R18 R26 = RS_3K: RES 3K OHM 1/10W 5% 0603 SMD; Storage Location: PCB Assembly WS; Supplier: ECE Dept; Value: 3K
R15 R16 R21-R24 = RS_0R0: RES 0.0 OHM 1/10W 5% 0603 SMD; Storage Location: PCB Assembly WS; Supplier: ECE Dept; Value: 0R
S1 S2 = WS_EVQPNF05M: Panasonic 6 x 3.5mm SMD Light Touch Switch Type SMD; PackageDescription: 6.0 x 3.5 mm; Supplier 1: Farnell; Supplier Part Number 1: 2079481; Manufacturer: Panasonic; Manufacturer PN: EVQPNF05M; Supplier 2: Digi-Key; Supplier Part Number 2: P13598SCT-ND; Storage Location: PCB Assembly WS; Supplier: ECE Dept
TP1 TP2 = TP_1206: Test-Point 3.3x1.6x2.1mm SMD; Manufacturer: Harwin Inc; Manufacturer Part Number: S1751-46R; Value: TP; Manufacturer PN: *; Storage Location: ProtoPlace; Mounting Type: Surface Mount; Type: PC Test Point; Supplier 1: Digi-Key; Supplier Part Number 1: 952-1478-2-ND; Supplier 2: Farnell; Supplier Part Number 2: 1826282; Supplier: ECE Dept
U1 = SE_ATSAM4S16BA-MU: IC MCU 32BIT 512KB FLASH 64LQFP; Manufacturer: Atmel; Connectivity: I²C, IrDA, Memory Card, SPI, SSC, UART/USART, USB; Core Processor: ARM® Cortex®-M4; Core Size: 32-Bit; Data Converters: A/D 11x12b, D/A 2x12b; Number of I/O: 47; Peripherals: Brown-out Detect/Reset, DMA, POR, PWM, WDT; Program Memory Size: 512KB (512K x 8); RAM Size: 128K x 8; Speed: 120MHz; Voltage - Supply (Vcc/Vdd): 1.62 V ~ 3.6 V; PackageVersion: revJ, Jul-2007; PackageReference: 64PS; PackageDescription: 64-Pin Quad Flat No-Lead (QFN) Sawn, 9 x 9 x 1.0 mm Body, 0.5 mm Pitch, Exposed Pad; Code_JEDEC: MO-220VMMD-3; ComponentLink1Description: Manufacturer URL; ComponentLink1URL: http://www.atmel.com/; ComponentLink2Description: SAM4S Series Datasheet; ComponentLink2URL: http://www.atmel.com/dyn/resources/prod_documents/11100.pdf; ComponentLink3Description: SAM4S Series Summary; ComponentLink3URL: http://www.atmel.com/dyn/resources/prod_documents/11100S.pdf; Supplier 1: Digi-Key; Package / Case: 64-LQFP; Packaging: Cut Tape (CT); Program Memory Type: FLASH; Supplier Part Number 1: ATSAM4S8BA-ANRCT-ND; Manufacturer Part Number: ATSAM4S8BA-ANR
U5 U8#1 = SN74LVC1T45: 1.8V - 5V level converter
Y1 = XT_CRYSTAL_12MHz_18pF: CRYSTAL 12MHZ 18PF 6X3.5mm SMD; Manufacturer: CTS-Frequency Controls; Manufacturer Part Number: 406C35D12M00000; ESR (Equivalent Series Resistance): 60 Ohm; Frequency Stability: ±50ppm; Frequency Tolerance: ±30ppm; Operating Mode: Fundamental; Supplier 1: Digi-Key; Height: 0.047" (1.20mm); Load Capacitance: 18pF; Mounting Type: Surface Mount; Operating Temperature: -20°C ~ 70°C; Package / Case: 4-SMD, No Lead (DFN, LCC); Size / Dimension: 0.236" L x 0.138" W (6.00mm x 3.50mm); Supplier Part Number 1: CTX855CT-ND; Frequency: 12MHz

## Sheet IMU_MPU-9250.SchDoc
size A3; Author: Group 19; Address1: ECE Department; Address2: University of Canterbury; Address3: Christchurch 8041; Address4: New Zealand; Revision: 1
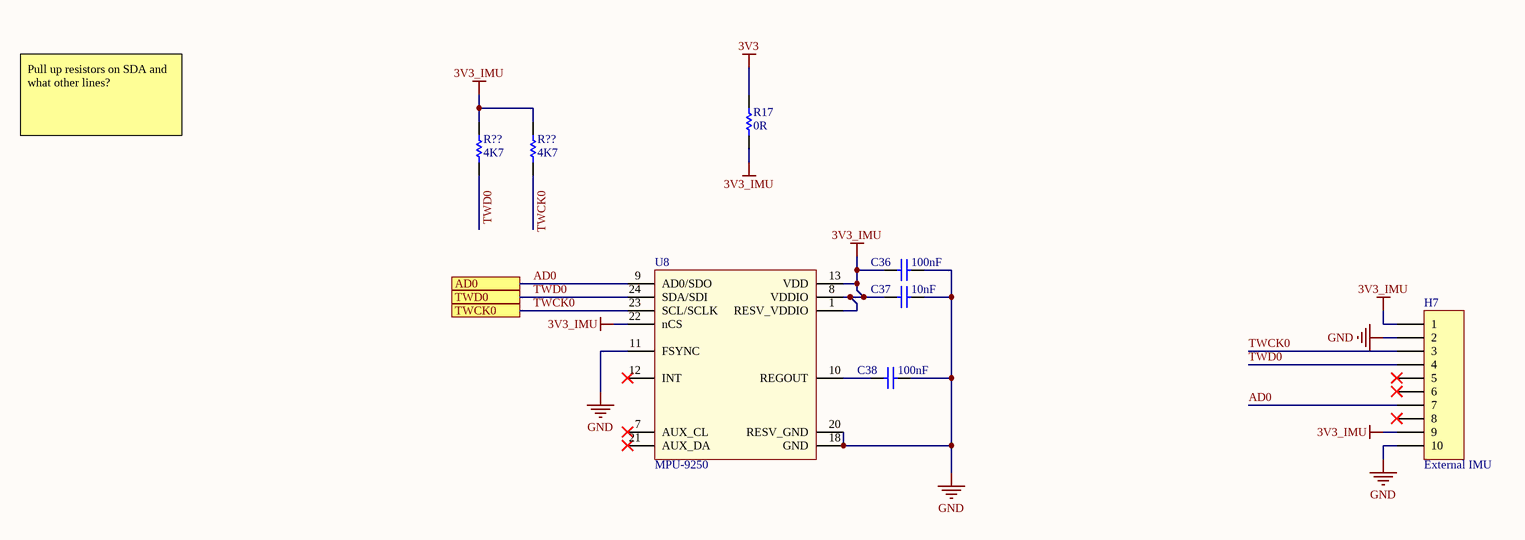
[diagram p5: IMU_MPU-9250.SchDoc]

### Parts
(Parts that share a designator on the sheet are numbered #1, #2 ... from top to bottom, then left to right.)
C36#2  100nF  [CAPC1608L]
C37#2  10nF  [CAPC1608L]
C38#2  100nF  [CAPC1608L]
H7#2  External IMU  [MOLEX_KK_10_HDR]
R17  0R  [RESC1608L]
R25  4K7  [RESC1608L]
R33  4K7  [RESC1608L]
U8#2  MPU-9250  [Quad24]

### Ports
AD0, TWCK0, TWD0

### Nets
3V3: R17.2
3V3_IMU: C36#2.1 C37#2.1 H7#2.1 H7#2.9 R17.1 R25.2 R33.2 U8#2.1(RESV_VDDIO) U8#2.8(VDDIO) U8#2.13(VDD) U8#2.22(nCS)
GND: C36#2.2 C37#2.2 C38#2.1 H7#2.2 H7#2.10 U8#2.11(FSYNC) U8#2.18(GND) U8#2.20(RESV_GND)
AD0: H7#2.7 U8#2.9(AD0/SDO) ; port AD0
TWCK0: H7#2.3 R25.1 U8#2.23(SCL/SCLK) ; port TWCK0
TWD0: H7#2.4 R33.1 U8#2.24(SDA/SDI) ; port TWD0
NetC38#2_2: C38#2.2 U8#2.10(REGOUT)

Not connected (* = marked no-connect by the designer): H7#2 5* 6* 8*; U8#2 7(AUX_CL)* 12(INT)* 21(AUX_DA)*

### Notes on the sheet
- Pull up resistors on SDA and what other lines?
- Title
- Drawn by:
- Date:
- Time:
- Revision:
- Sheet
- of
- File:

### Library data of the parts
C36#2 C38#2 = CC_100nF_0603: CAP CER 100nF X7R +-10% 50V 0603; PackageReference: 0603; Code_IPC: 1608 [0603]; Verify: *; Supplier: ECE Dept; Storage Location: PCB Assembly WS; Value: 100nF
C37#2 = CC_10nF_0603: CAP CER 10nF X7R +-10% 50V 0603; PackageReference: 0603; Code_IPC: 1608 [0603]; Verify: *; Supplier: ECE Dept; Storage Location: PCB Assembly WS; Value: 10nF
H7#2 = JA_MOLEX_KK_10POS: CONN HEADER 10POS 2.54mm VERT_ Thru Hole; Supplier 1: Farnell; Supplier Part Number 1: 1756828; Supplier: ECE Dept; Storage Location: ECE Dept Store; Value: External IMU
R17 = RS_0R0: RES 0.0 OHM 1/10W 5% 0603 SMD; Storage Location: PCB Assembly WS; Supplier: ECE Dept; Value: 0R
R25 R33 = RS_4K7: RES 4.7K OHM 1/10W 5% 0603 SMD; Storage Location: PCB Assembly WS; Supplier: ECE Dept; Value: 4K7
U8#2 = MPU-9250: 9 axis IMU

## Nets that join several sheets
3V3: Battery_and_Power (C31.2 S3.7 S3.8), SAM4S_MCU_Racer (17 pins), IMU_MPU-9250 (R17.2)
3V3_PROG: Battery_and_Power (S3.2), SAM4S_MCU_Racer (H2.7 H2.8)
3V3_RADIO: Battery_and_Power (C34.2 U7.5), Radio (H10.2 R19.2)
5V: Battery_and_Power (8 pins), SAM4S_MCU_Racer (15 pins)
GND: Battery_and_Power (20 pins), Motor_Drivers (8 pins), Radio (C35.1 C39.1 H10.1 U6.2), SAM4S_MCU_Racer (59 pins), IMU_MPU-9250 (8 pins)
VBAT: Battery_and_Power (C16.2 F2.1 Q1.2 U3.3), Motor_Drivers (5 pins), SAM4S_MCU_Racer (C50.2 H17.1)
VBAT_RAW: Battery_and_Power (F1.2 Q1.3), SAM4S_MCU_Racer (R9.2)
VBUS: Battery_and_Power (S3.4), SAM4S_MCU_Racer (H1.1 R1.2)
MISO: Radio (H10.7 U6.7), SAM4S_MCU_Racer (U1.27)
MOSI: Radio (H10.6 U6.6), SAM4S_MCU_Racer (U1.22)
NetR??_2: Battery_and_Power (R??.2 U7.3), SAM4S_MCU_Racer (U1.38)
NetU1_41: Motor_Drivers (U4.1), SAM4S_MCU_Racer (U1.41)
NetU1_42: Motor_Drivers (U4.8), SAM4S_MCU_Racer (U1.42)
NetU1_44: Motor_Drivers (U4.15), SAM4S_MCU_Racer (U1.44)
NetU1_47: Motor_Drivers (U4.10), SAM4S_MCU_Racer (U1.47)
PWMH1_A: Motor_Drivers (H8.2 U4.9), SAM4S_MCU_Racer (U1.23)
PWMH2_A: Motor_Drivers (H7#1.2 U4.16), SAM4S_MCU_Racer (U1.25)
RADIO_CE: Radio (H10.3 U6.3), SAM4S_MCU_Racer (U1.19)
RADIO_CSN: Radio (H10.4 U6.4), SAM4S_MCU_Racer (U1.20)
RADIO_IRQ: Radio (H10.8 U6.8), SAM4S_MCU_Racer (U1.28)
SCK: Radio (H10.5 U6.5), SAM4S_MCU_Racer (U1.21)
TWCK0: SAM4S_MCU_Racer (U1.36), IMU_MPU-9250 (H7#2.3 R25.1 U8#2.23)
TWD0: SAM4S_MCU_Racer (U1.43), IMU_MPU-9250 (H7#2.4 R33.1 U8#2.24)